# Altium schematic sheet CFT.SchDoc
size A; SheetNumber: 1; SheetTotal: 1
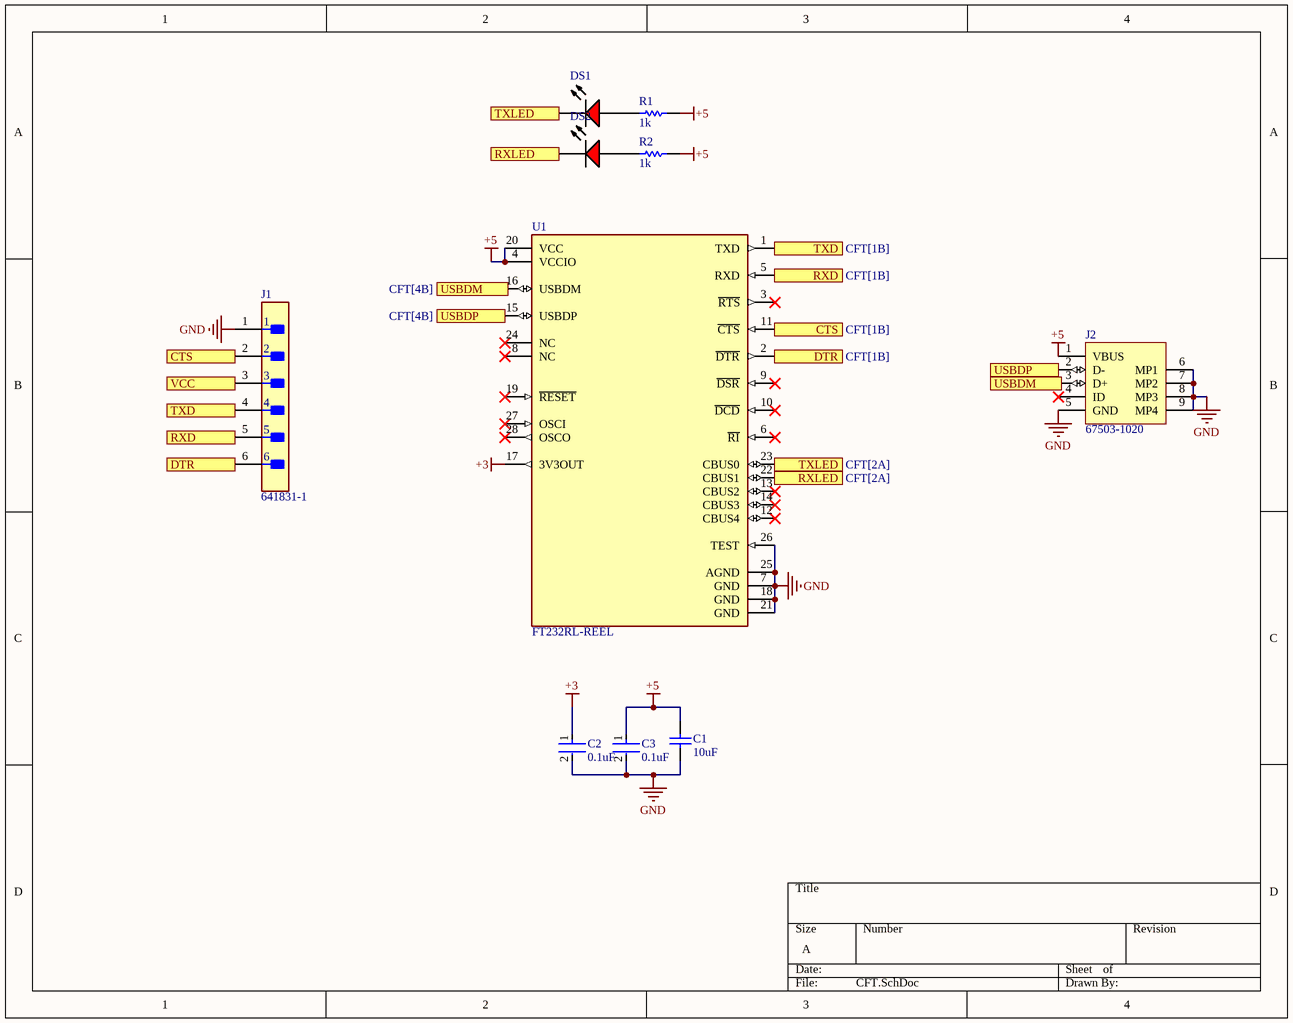
[diagram p0: CFT.SchDoc]

## Parts
C1  10uF  [CAPC2013X135X45NL10T25]
C2  0.1uF  [FP-GCM155-0_05-IPC_C]
C3  0.1uF  [FP-GCM155-0_05-IPC_C]
DS1  Red  [VISH-TLMX1100_V]  (value not drawn)
DS2  TLMS1100-GS08  [VISH-TLMX1100_V]  (value not drawn)
J1  641831-1  [FP-641831-1-MFG]
J2  67503-1020  [MOLX-67503-1020_V]
R1  1k  [RESC2013X60X35ML10T20]
R2  1k  [RESC2013X60X35ML10T20]
U1  FT232RL-REEL  [FP-SSOP-28-MFG]

## Ports
CTS (see CFT[1B]), CTS (see CFT[3B]), DTR (see CFT[1B]), DTR (see CFT[3B]), RXD (see CFT[1B]), RXD (see CFT[3B]), RXLED (see CFT[2A]), RXLED (see CFT[3B]), TXD (see CFT[1B]), TXD (see CFT[3A]), TXLED (see CFT[2A]), TXLED (see CFT[3B]), USBDM (see CFT[2B]), USBDM (see CFT[4B]), USBDP (see CFT[2B]), USBDP (see CFT[4B]), VCC

## Nets
+3: C2.1 U1.17(3V3OUT)
+5: C1.2 C3.1 J2.1(VBUS) R1.2 R2.2 U1.4(VCCIO) U1.20(VCC)
GND: C1.1 C2.2 C3.2 J1.1 J2.5(GND) J2.6(MP1) J2.7(MP2) J2.8(MP3) J2.9(MP4) U1.7(GND) U1.18(GND) U1.21(GND) U1.25(AGND) U1.26(TEST)
CTS: J1.2 U1.11(~{CTS}) ; port CTS
DTR: J1.6 U1.2(~{DTR}) ; port DTR
RXD: J1.5 U1.5(RXD) ; port RXD
RXLED: DS2.2(K) U1.22(CBUS1) ; port RXLED
TXD: J1.4 U1.1(TXD) ; port TXD
TXLED: DS1.2(K) U1.23(CBUS0) ; port TXLED
USBDP: J2.2(D-) U1.15(USBDP) ; port USBDP
VCC: J1.3 ; port VCC
NetDS1_1: DS1.1(A) R1.1
NetDS2_1: DS2.1(A) R2.1

Not connected (* = marked no-connect by the designer): J2 3(D+) 4(ID)*; U1 3(~{RTS})* 6(~{RI})* 8(NC)* 9(~{DSR})* 10(~{DCD})* 12(CBUS4)* 13(CBUS2)* 14(CBUS3)* 16(USBDM) 19(~{RESET})* 24(NC)* 27(OSCI)* 28(OSCO)*

## Library data of the parts
C1 = CMP-2007-03514-1: Manufacturer: Murata; Part Number: GRM21BF51C106ZE15L
C2 C3 = CMP-2008-03711-3: Ceramic Capacitor for Automotive 100nF ±10% 16VDC X7R 0402 Paper T/R; Voltage Rating (DC): 16V; Termination: SMD/SMT; Length: 1mm; Voltage: 16V; Mount: Surface Mount; Packaging: Tape and Reel; Case Code (Metric): 1005; Case/Package: 0402; Voltage Rating: 16V; Min Operating Temperature: -55°C; Case Code (Imperial): 0402; Ratings: AEC-Q200; Height: 0.5mm; Tolerance: 10%; Width: 0.02inch; Radiation Hardening: No; Depth: 0.5mm; Capacitance: 100nF; Max Operating Temperature: 125°C; Package Quantity: 1; REACH SVHC: No SVHC; Thickness: 0.022inch; Dielectric: X7R; Lead Free: Lead Free
DS1 DS2 = CMP-1666-00027-1: LED, RED, 2.1 V, -40 to 100 degC, 2-Pin SMD (0603), RoHS, Tape and Reel; Type (Capacitors): C0G; Resistance: 100000000000 Ohm; Capacitance: 12 pF; Voltage Rating: 50 V; Tolerance: 5%; Min Operating Temperature: -55degC; REACH SVHC: No SVHC; ComponentLink2Description: Datasheet; ComponentLink1URL: http://www.vishay.com/; Width: 0.8 mm; Package Quantity: 4000; PackageReference: TLMX1100; ComponentLink2URL: http://www.vishay.com/docs/83173/tlmb1100.pdf; Case/Package: 0603; Case Code (Metric): 1608; Packaging: Tape and Reel; Pins: 2; ComponentLink1Description: Manufacturer URL; Max Operating Temperature: 125degC; Height: 0.8 mm; Length: 1.6 mm; Mount: Surface Mount; PackageDescription: 2-Pin Surface Mount Device, Body 1.6 x 0.8 mm; DatasheetVersion: Rev. 2.7, 03/2016; Case Code (Imperial): 0603; Voltage Rating (DC): 50 V; RoHSCompliant: True; Radiation Hardening: No
J1 = CMP-03369-000074-1: CONN HEADER VERT 6POS 6.35MM; Manufacturer: TE; Description: CONN HEADER 6POS VERT .250 TIN; Standoff Height: 0.63mm; Number Of Contacts: 6; Conn Orientation: Vertical; Conn Gender: Male; Voltage Rating: 600V; Current Rating: 19A; Pitch: 6.35mm; Category: Conn; Contact Material: Gold,Nickel; Device Class L1: Connectors; Temperature Range High: +105°C; Digikey Description: CONN HEADER VERT 6POS 6.35MM; Mouser Description: Pin & Socket Connectors 6P PIN HDR ASSY; Height: 14.99mm; Lead Free: Yes; Manufacturer Part Number: 641831-1; ComponentLink2Description: Datasheet; Temperature: -55°C to +105°C; Device Class L3: unset; RoHS: TRUE; Automotive: No; Temperature Range Low: -55°C; Number Of Rows: 1; Octopart: https://octopart.com/641831-1-te+connectivity-40465174; ComponentLink2URL: https://www.te.com/usa-en/product-641831-1.html?te_bu=Cor&te_type=other&te_campaign=oct_glo_cor-oct-global-oth-prtnr-fy19-oct-octo-buy-bom_sma-298_2&elqCampaignId=35216; Device Class L2: Headers and Wire Housings; Package: 641831-1
J2 = CMP-0411-00002-1: USB, MINI, SMD, RA KME04-USBMU03A01; Manufacturer: Molex; ComponentLink1URL: http://www.molex.com/; PartNumber: 67503-1020; Mounting Technology: Surface Mount; ComponentLink1Description: Manufacturer URL; Terminal Pitch: 0.8 mm; DatasheetVersion: Rev F, 06/2009; ComponentLink2Description: Datasheet; PackageDescription: Mini USB Connector, SMT, Righer Angle; ComponentLink2URL: http://www.molex.com/pdm_docs/sd/675031020_sd.pdf; PackageReference: 67503-1020
R1 R2 = CMP-2100-03671-1: Chip Resistor, 1 KOhm, +/- 1%, 125 mW, -55 to 155 degC, 0805 (2012 Metric), RoHS, Tape and Reel; Manufacturer: Yageo; Temperature Coefficient: 100ppm/degreesC; Voltage Rating (DC): 150V; Max Power Dissipation: 125mW; Resistance: 1KOhm; Number of Pins: 2; Number of Terminations: 2; Datasheet URL: http://www.yageo.com/NewPortal/yageodocoutput?fileName=/pdf/R-Chip/PYu-RC_Group_51_RoHS_L_5.pdf; Length: 0.079inch; Package Description: 2-Pin Surface Mounted Device, Body 2 x 1.25 mm; Depth: 1.25mm; Height: 0.024inch; Military Standard: Not; Case/Package: 0805; Package Reference: 0805; RoHSCompliant: true; Lead Free: LeadFree; Packaging: TapeandReel; Package Quantity: 1; Datasheet Version: Rev. 5, 10/2016; Tolerance: 1%; Min Operating Temperature: -55degC; Voltage Rating: 150V; Composition: ThickFilm; Case Code (Imperial): 0805; Power Rating: 125mW; Width: 0.049inch; Case Code (Metric): 2012; Manufacturer URL: http://www.yageo.com/; Max Operating Temperature: 155degC; REACH SVHC: Unknown; Termination: SMD/SMT
U1 = CMP-0078-00029-4: IC USB FS SERIAL UART 28-SSOP; Data Rate: 12Mbps; Max Supply Voltage: 5.25V; Operating Supply Current: 15mA; Number of Channels: 1; Voltage: 5V; Min Supply Voltage: 3.3V; Radiation Hardening: No; Mount: Surface Mount; Min Operating Temperature: -40°C; Package Quantity: 2000; Number of Transceivers: 1; Width: 5.3mm; Number of Pins: 28; Height: 1.75mm; Weight: 0.080001oz; Lead Free: Lead Free; Length: 10.2mm; REACH SVHC: No SVHC; Max Operating Temperature: 85°C; Packaging: Tape and Reel; Interface: UART; Case/Package: SSOP